# EAGLE schematic CH4D3M0 Rev 1 (EAGLE 7.7.0)
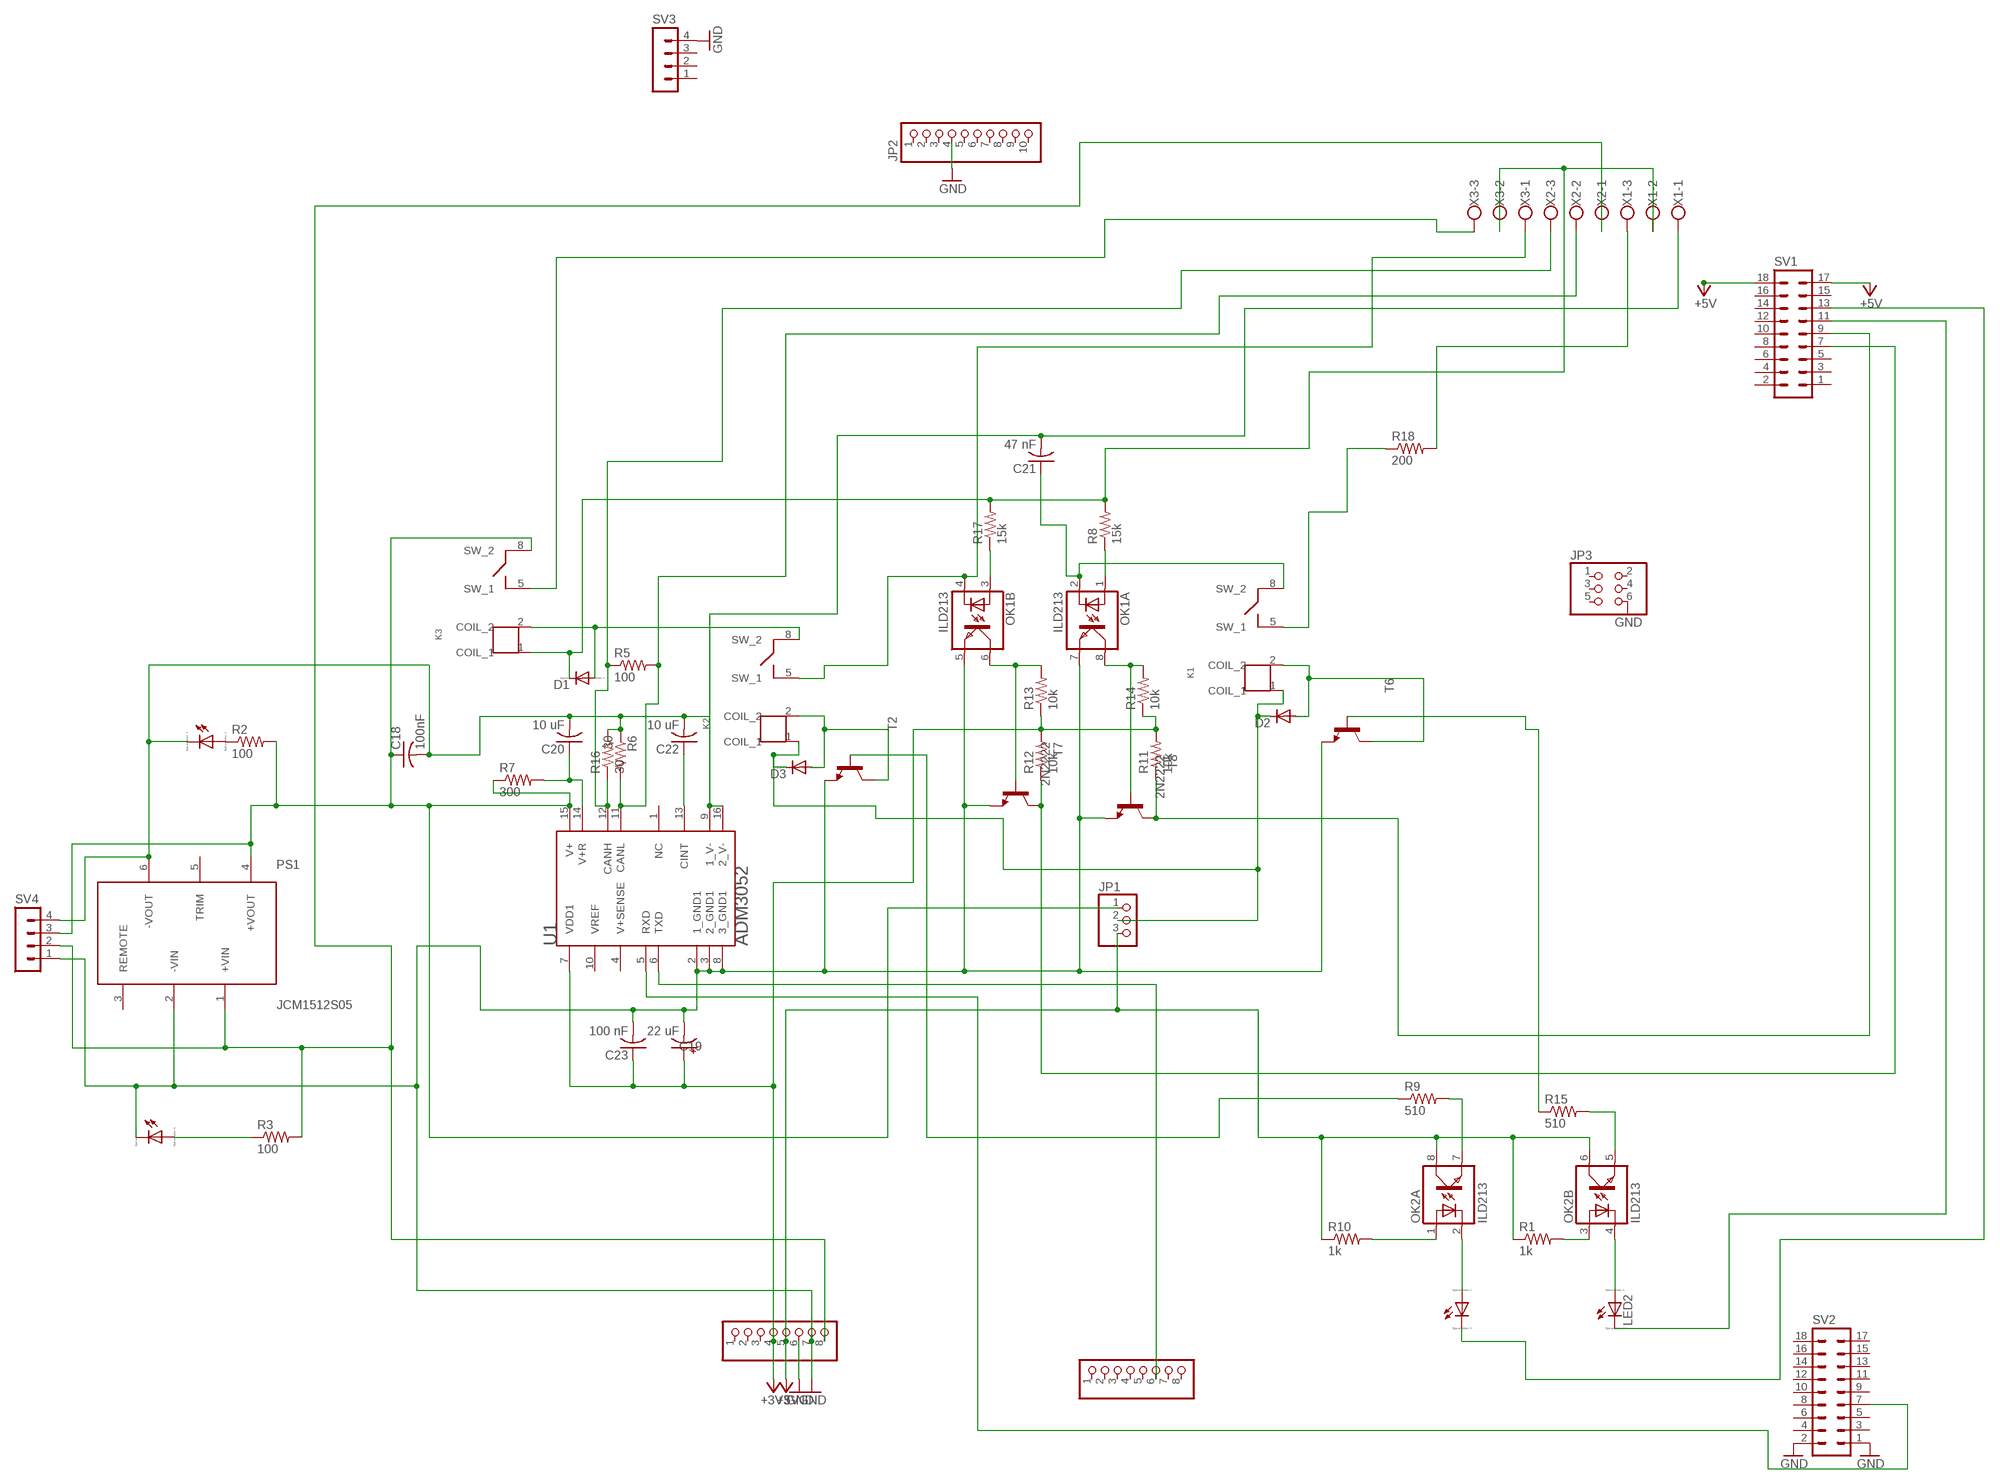
[diagram p0: schematic, sheet 1]

## Parts
ADCH  PINHD-1X8  [1X08]
ADCH2  PINHD-1X8  [1X08]
C18  100nF  C-US025-024X044  [C025-024X044]
C19  22 uF  CPOL-USE2.5-4V  [E2,5RE]
C20  10 uF  C-US025-024X044  [C025-024X044]
C21  47 nF  C-US025-024X044  [C025-024X044]
C22  10 uF  C-US025-024X044  [C025-024X044]
C23  100 nF  C-US025-024X044  [C025-024X044]
D1  DIODE-D-5  [D-5]
D2  DIODE-D-5  [D-5]
D3  DIODE-D-5  [D-5]
JP1  PINHD-1X3  [1X03]
JP2  PINHD-1X10  [1X10]
JP3  PINHD-2X3  [2X03]
K1  G6DN-1ATHROUGH_HOLE  [G6DN-1A]
K2  G6DN-1ATHROUGH_HOLE  [G6DN-1A]
K3  G6DN-1ATHROUGH_HOLE  [G6DN-1A]
LED1  LED_ELD260  [LED_LD260]
LED2  LED_ELD260  [LED_LD260]
LED3  LED_ELD260  [LED_LD260]
LED4  LED_ELD260  [LED_LD260]
OK1  ILD213  [SOIC08]
OK2  ILD213  [SOIC08]
PS1  JCM1512S05  JCMXXTHROUGH_HOLE  [JCMXX]
R1  1k  R-US_0204/7  [0204/7]
R2  100  R-US_0204/7  [0204/7]
R3  100  R-US_0204/7  [0204/7]
R5  100  R-US_0204/7  [0204/7]
R6  30  R-US_0204/7  [0204/7]
R7  300  R-US_0204/7  [0204/7]
R8  15k  R-US_0204/7  [0204/7]
R9  510  R-US_0204/7  [0204/7]
R10  1k  R-US_0204/7  [0204/7]
R11  10k  R-US_0204/7  [0204/7]
R12  10k  R-US_0204/7  [0204/7]
R13  10k  R-US_0204/7  [0204/7]
R14  10k  R-US_0204/7  [0204/7]
R15  510  R-US_0204/7  [0204/7]
R16  30  R-US_0204/7  [0204/7]
R17  15k  R-US_0204/7  [0204/7]
R18  200  R-US_0204/7  [0204/7]
SV1  MA09-2  [MA09-2]
SV2  MA09-2  [MA09-2]
SV3  MA04-1  [MA04-1]
SV4  MA04-1  [MA04-1]
T2  BC547-NPN-TO92-CBE  [TO92-CBE]
T6  BC547-NPN-TO92-CBE  [TO92-CBE]
T7  2N2222  [TO92-EBC-OVAL]
T8  2N2222  [TO92-EBC-OVAL]
U1  ANALOG_DEVICES_INC_ADM3052ANALOG_DEVICES_INC_ADM3052_0_0  [ANALOG_DEVICES_INC_ADM3052_0]
X1  W237-103  [W237-103]
X2  W237-103  [W237-103]
X3  W237-103  [W237-103]

## Nets
+3V3: ADCH2.4 C19.+ C23.1 R11.2 R12.2 R13.1 R14.1 U1.7(VDD1)
+5V: ADCH2.5 JP1.3 OK2.6(B:COL) OK2.8(A:COL) R1.1 R10.1 SV1.17 SV1.18
GND: ADCH2.6 ADCH2.7 C19.- C23.2 JP2.4 JP3.6 LED4.K(C) OK1.5(B:EMIT) OK1.7(A:EMIT) PS1.2(-VIN) SV2.1 SV2.2 SV3.4 SV4.1 T2.E T6.E T7.E T8.E U1.2(1_GND1) U1.3(2_GND1) U1.8(3_GND1)
N$1: D2.C D3.C JP1.2 K1.1(COIL_1) K2.1(COIL_1)
N$2: C18.1 JP1.1 K3.8(SW_2) PS1.4(+VOUT) R2.2 R7.1 SV4.3 U1.15(V+)
N$3: C20.1 R7.2 U1.14(V+R)
N$4: C22.1 U1.13(CINT)
N$5: K3.5(SW_1) X3.3
N$6: R18.2 X1.3
N$7: C18.2 C20.2 C21.2 C22.2 LED3.K(C) PS1.6(-VOUT) R6.1 R16.2 SV4.4 U1.9(1_V-) U1.16(2_V-) X1.1
N$8: R5.2 R6.2 U1.11(CANL) X2.2
N$9: C21.1 K1.8(SW_2) OK1.2(A:C)
N$10: K1.5(SW_1) R18.1
N$11: D1.C K3.1(COIL_1) R8.2 R17.2 X1.2 X3.2
N$12: OK1.1(A:A) R8.1
N$13: OK1.3(B:A) R17.1
N$14: ADCH2.8 PS1.1(+VIN) R3.2 SV4.2 X2.1
N$15: D1.A K2.8(SW_2) K3.2(COIL_2)
N$16: K2.5(SW_1) OK1.4(B:C) X3.1
N$17: OK1.6(B:COL) R13.2 T7.B
N$18: OK1.8(A:COL) R14.2 T8.B
N$19: R12.1 SV1.7 T7.C
N$20: ADCH.6 U1.6(TXD)
N$21: R11.1 SV1.9 T8.C
N$22: SV2.7 U1.5(RXD)
N$23: D2.A K1.2(COIL_2) T6.C
N$24: D3.A K2.2(COIL_2) T2.C
N$25: OK2.7(A:EMIT) R9.2
N$26: LED1.A OK2.2(A:C)
N$27: OK2.1(A:A) R10.2
N$28: OK2.3(B:A) R1.2
N$29: R9.1 T2.B
N$30: LED1.K(C) SV1.13
N$31: R15.1 T6.B
N$32: OK2.5(B:EMIT) R15.2
N$33: LED2.A OK2.4(B:C)
N$34: LED2.K(C) SV1.11
N$35: R5.1 R16.1 U1.12(CANH) X2.3
N$36: LED3.A R2.1
N$37: LED4.A R3.1
Unconnected: ADCH2.1 ADCH2.2 ADCH2.3 ADCH.1 ADCH.2 ADCH.3 ADCH.4 ADCH.5 ADCH.7 ADCH.8 JP2.1 JP2.2 JP2.3 JP2.5 JP2.6 JP2.7 JP2.8 JP2.9 JP2.10 JP3.1 JP3.2 JP3.3 JP3.4 JP3.5 PS1.3(REMOTE) PS1.5(TRIM) SV1.1 SV1.2 SV1.3 SV1.4 SV1.5 SV1.6 SV1.8 SV1.10 SV1.12 SV1.14 SV1.15 SV1.16 SV2.3 SV2.4 SV2.5 SV2.6 SV2.8 SV2.9 SV2.10 SV2.11 SV2.12 SV2.13 SV2.14 SV2.15 SV2.16 SV2.17 SV2.18 SV3.1 SV3.2 SV3.3 U1.1(NC) U1.4(V+SENSE) U1.10(VREF)

## Library data of the parts
ADCH ADCH2 = pinhead1:PINHD-1X8: PIN HEADER
C18 C20-C23 = rcl:C-US: CAPACITOR, American symbol
C19 = rcl:CPOL-US: POLARIZED CAPACITOR, American symbol
D1-D3 = diode:DIODE-: DIODE
JP1 = adafruit:PINHD-1X3: PIN HEADER
JP2 = pinhead1:PINHD-1X10: PIN HEADER
JP3 = pinhead1:PINHD-2X3: PIN HEADER
K1-K3 = G6DN-1A:G6DN-1A: Generic OMRON Mini-Relay footprint
LED1-LED4 = eagle-ltspice:LED_E: LED Source: http://www.osram.convergy.de Source: www.luxeon.com Source: www.kingbright.com; SPICEMODEL: NONE; SPICEPREFIX: D; SPICETYPE: diode
OK1 OK2 = optocoupler:ILD2*: Siemens ILD205/206/207/211/213/217 DUAL PHOTOTRANSISTOR SMALL OUTLINE SURFACE MOUNT OPTOCOUPLER Source: 153385-da-01-en-Optocoupler_ILD205-T.pdf; MF: VISHAY/TELEFUNKEN; MPN: ILD213T; OC_FARNELL: 1045451; OC_NEWARK: 20H8680
PS1 = JCMxx:JCMXX: 1.6kV Isolated DC to DC converter (8-18V in, 5V out)
R1-R3 R5-R18 = rcl:R-US_: RESISTOR, American symbol
SV1 SV2 = con-lstb:MA09-2: PIN HEADER; OC_FARNELL: unknown; OC_NEWARK: unknown
SV3 SV4 = con-lstb1:MA04-1: PIN HEADER; OC_FARNELL: unknown; OC_NEWARK: unknown
T2 T6 = transistor1:*-NPN-: NPN Transistror BF959 corrected 2008.03.06
T7 T8 = adafruit1:2N2222: NPN TRANSISTOR Big oval pads
U1 = Analog Devices Inc - ADM3052:ANALOG_DEVICES_INC_ADM3052: Isolated CAN Transceiver with Integrated High Voltage, Bus-Side, Linear Regulator; CENTROID_NOT_SPECIFIED: No; DATASHEET: http://www.analog.com/media/en/technical-documentation/data-sheets/ADM3052.pdf; DIGIKEY_DESCRIPTION: IC DGTL ISOLATOR 5KV 3CH CAN 16SOIC; DIGIKEY_PART_NUMBER: ADM3052BRWZ-REEL7; IPC_LAND_PATTERN_NAME: SOIC127P1032X250-16; LEAD_FREE: yes; MF: Analog Devices Inc; MFG_PACKAGE_IDENT: RW-16; MOUSER_PART_NUMBER: 584-ADM3052BRWZ-R7; MPN: ADM3052; PACKAGE: SOIC-16; PREFIX: U; ROHS: yes; TEMPERATURE_RANGE_HIGH: +85°C; TEMPERATURE_RANGE_LOW: -40°C
X1-X3 = con-wago-500_1:W237-103: WAGO SCREW CLAMP; MPN: 237-103; OC_FARNELL: unknown; OC_NEWARK: 18M7116

## Net classes
0 default: width 0.15 mm, drill 0.3 mm, clearance 0.205 mm